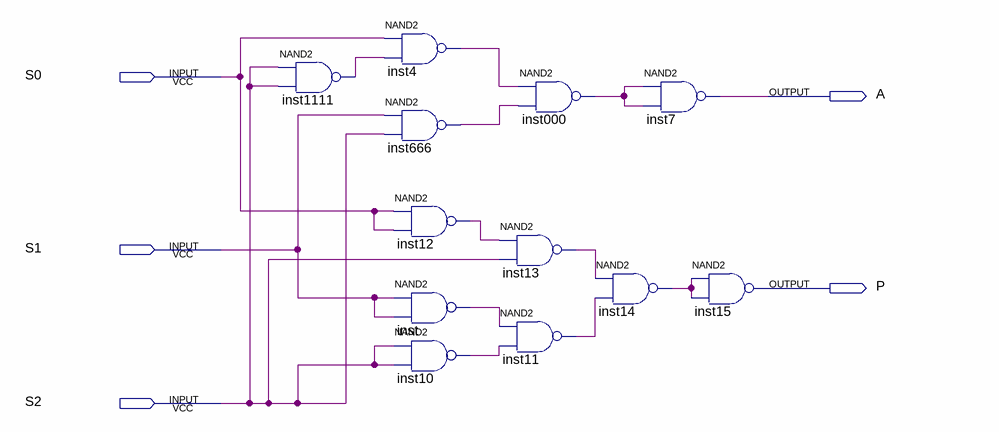
[diagram p0: schematic sheet]
// Quartus schematic lab5.bdf as structural Verilog: 12 symbols, 5 pins
module lab5 (
  input  S0,
  input  S1,
  input  S2,
  output A,
  output P
);

  wire inst000_out, inst4_out, inst10_out, inst11_out, inst12_out, inst13_out, inst14_out, inst666_out,
       inst1111_out, inst_out;

  nand inst1111 (inst1111_out, S2, S2);
  nand inst4 (inst4_out, S0, inst1111_out);
  nand inst666 (inst666_out, S1, S2);
  nand inst12 (inst12_out, S0, S0);
  nand inst (inst_out, S1, S1);
  nand inst10 (inst10_out, S2, S2);
  nand inst000 (inst000_out, inst4_out, inst666_out);
  nand inst13 (inst13_out, inst12_out, S2);
  nand inst11 (inst11_out, inst_out, inst10_out);
  nand inst14 (inst14_out, inst13_out, inst11_out);
  nand inst7 (A, inst000_out, inst000_out);
  nand inst15 (P, inst14_out, inst14_out);
endmodule
